# EAGLE design TA_1 (EAGLE 9.6.2)
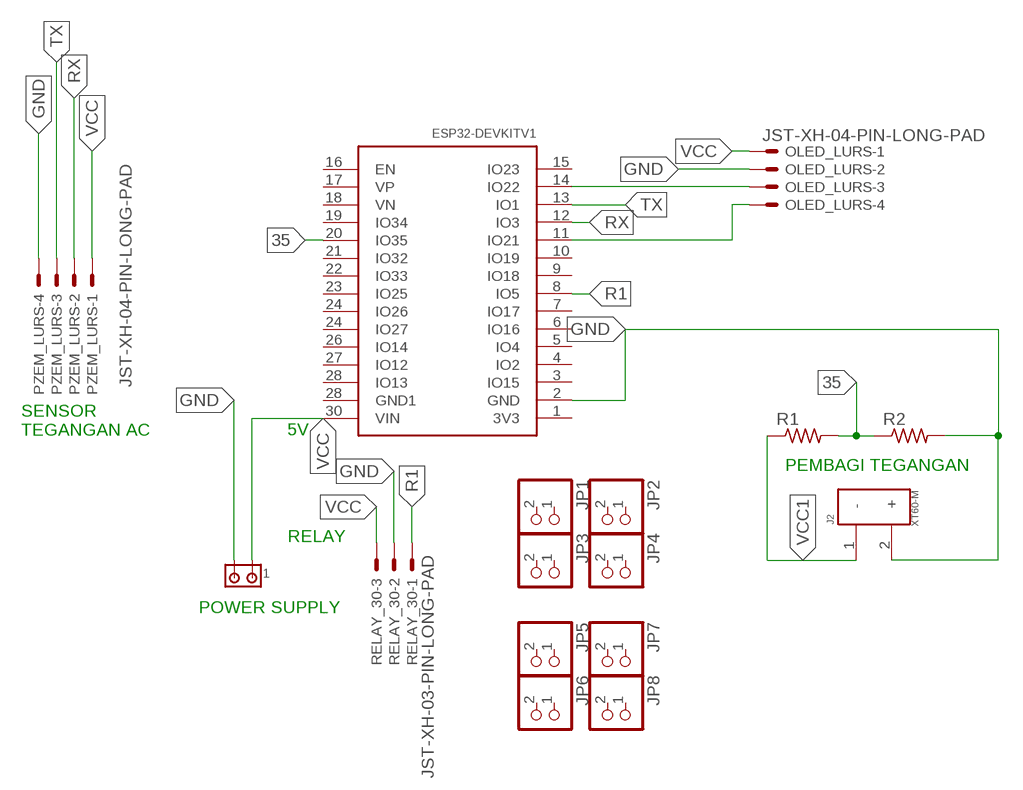
[diagram p0: schematic, sheet 1]

## Parts
J1  350428-1  [350428-1]
J2  XT60-M  [AMASS_XT60-M]
JP1  PINHD-1X2  [1X02]
JP2  PINHD-1X2  [1X02]
JP3  PINHD-1X2  [1X02]
JP4  PINHD-1X2  [1X02]
JP5  PINHD-1X2  [1X02]
JP6  PINHD-1X2  [1X02]
JP7  PINHD-1X2  [1X02]
JP8  PINHD-1X2  [1X02]
OLED_LURS  JST-XH-04-PIN-LONG-PAD  [JST-XH-04-PACKAGE-LONG-PAD]
PZEM_LURS  JST-XH-04-PIN-LONG-PAD  [JST-XH-04-PACKAGE-LONG-PAD]
R1  R-US_0207/10  [0207/10]
R2  R-US_0207/10  [0207/10]
RELAY_30  JST-XH-03-PIN-LONG-PAD  [JST-XH-03-PACKAGE-LONG-PAD]
U$1  ESP32DEVKITV1  [ESP32-DEVKITV1]

## Nets
35: R1.2 R2.1 U$1.20(IO35)
GND: J1.2 J2.2(+) OLED_LURS.2 PZEM_LURS.4 R2.2 RELAY_30.2 U$1.2(GND)
N$7: OLED_LURS.4 U$1.11(IO21)
N$8: OLED_LURS.3 U$1.14(IO22)
R1: RELAY_30.1 U$1.8(IO5)
RX: PZEM_LURS.2 U$1.12(IO3)
TX: PZEM_LURS.3 U$1.13(IO1)
VCC: J1.1 OLED_LURS.1 PZEM_LURS.1 RELAY_30.3 U$1.30(VIN)
VCC1: J2.1(-) R1.1
Unconnected: JP1.1 JP1.2 JP2.1 JP2.2 JP3.1 JP3.2 JP4.1 JP4.2 JP5.1 JP5.2 JP6.1 JP6.2 JP7.1 JP7.2 JP8.1 JP8.2 U$1.1(3V3) U$1.3(IO15) U$1.4(IO2) U$1.5(IO4) U$1.6(IO16) U$1.7(IO17) U$1.9(IO18) U$1.10(IO19) U$1.15(IO23) U$1.16(EN) U$1.17(VP) U$1.18(VN) U$1.19(IO34) U$1.21(IO32) U$1.22(IO33) U$1.23(IO25) U$1.24(IO26) U$1.24(IO27) U$1.26(IO14) U$1.27(IO12) U$1.28(GND1) U$1.28(IO13)

## Notes on the sheet
- SENSOR 
  TEGANGAN AC
- 5V
- PEMBAGI TEGANGAN
- RELAY
- POWER SUPPLY

## Library data of the parts
J1 = con-amp:350428-1: Universal MATE-N-LOK .250" Centerline, 600 V, 19 - 36 A max Source: http://catalog.tycoelectronics.com/ .. ENG_CD_350428_Y.pdf
J2 = XT60-M:XT60-M: DC supply; XT60; male; PIN:2; for cable; soldered; 60A; 500V Check availability <https://pricing.snapeda.com/parts/XT60-M/AMASS/view-part?ref=eda>; AVAILABILITY: Not in stock; DESCRIPTION: Plug; DC supply; XT60; male; PIN: 2; for cable; soldered; 30A; 500V; MF: AMASS; MP: XT60-M; PACKAGE: Package; PRICE: None
JP1-JP8 = pinhead:PINHD-1X2: PIN HEADER
OLED_LURS PZEM_LURS = Rembrandt Electronics - JST XH Connectors v1-0:JST-XH-04-PIN: JST XH Connector 2 Pin Wire to board connector. Pitch: 2,54 mm, (0.100") Number of pins: 4 Created by Rembrandt Electronics www.rembrandtelectronics.com
R1 R2 = rcl:R-US_: RESISTOR, American symbol; SPICEPREFIX: R
RELAY_30 = Rembrandt Electronics - JST XH Connectors v1-0:JST-XH-03-PIN: JST XH Connector 2 Pin Wire to board connector. Pitch: 2,54 mm, (0.100") Number of pins: 3 Created by Rembrandt Electronics www.rembrandtelectronics.com
U$1 = ESP32-DEVKITV1:ESP32DEVKITV1

## Module OLED
Ports: 

### Library data of the parts

## Board
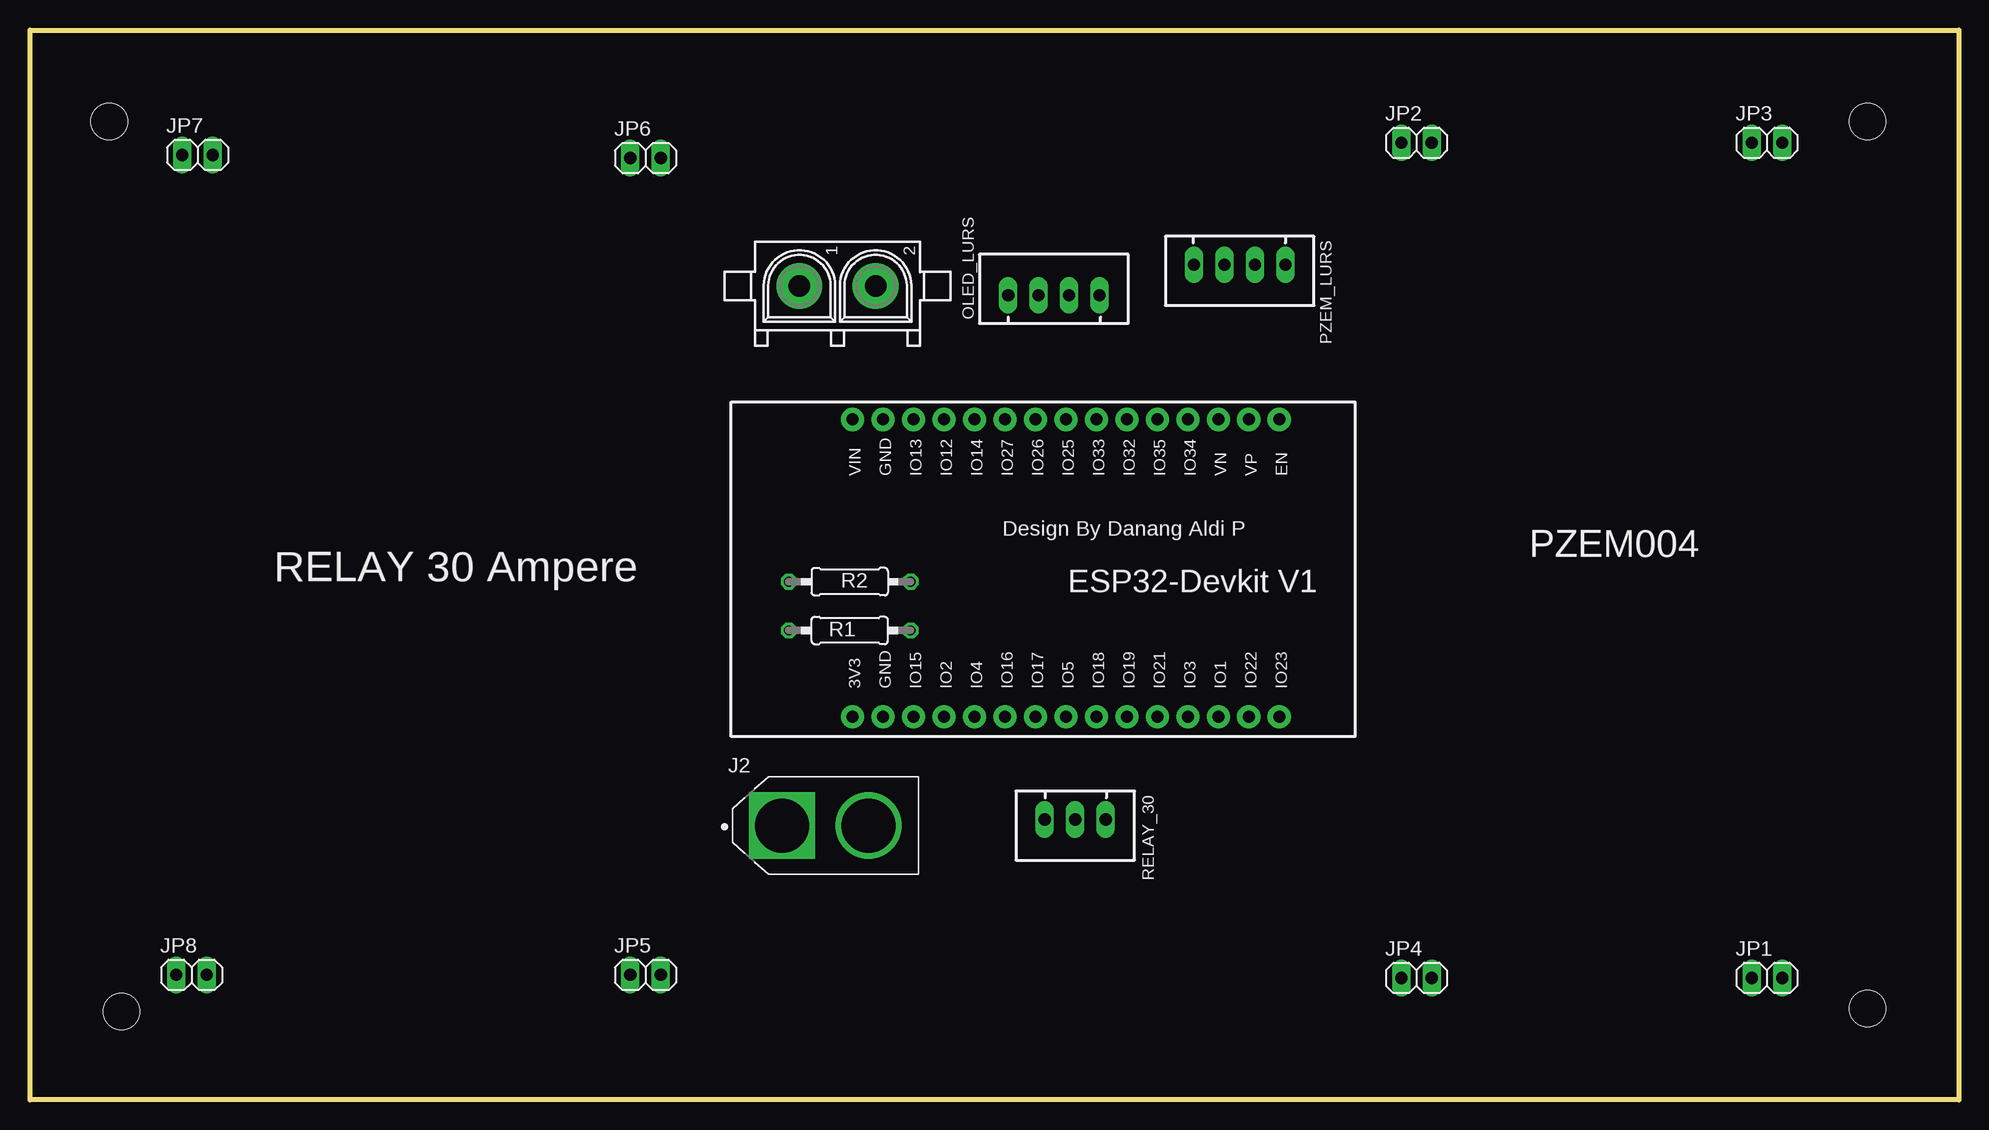
[diagram p1: board, top side]
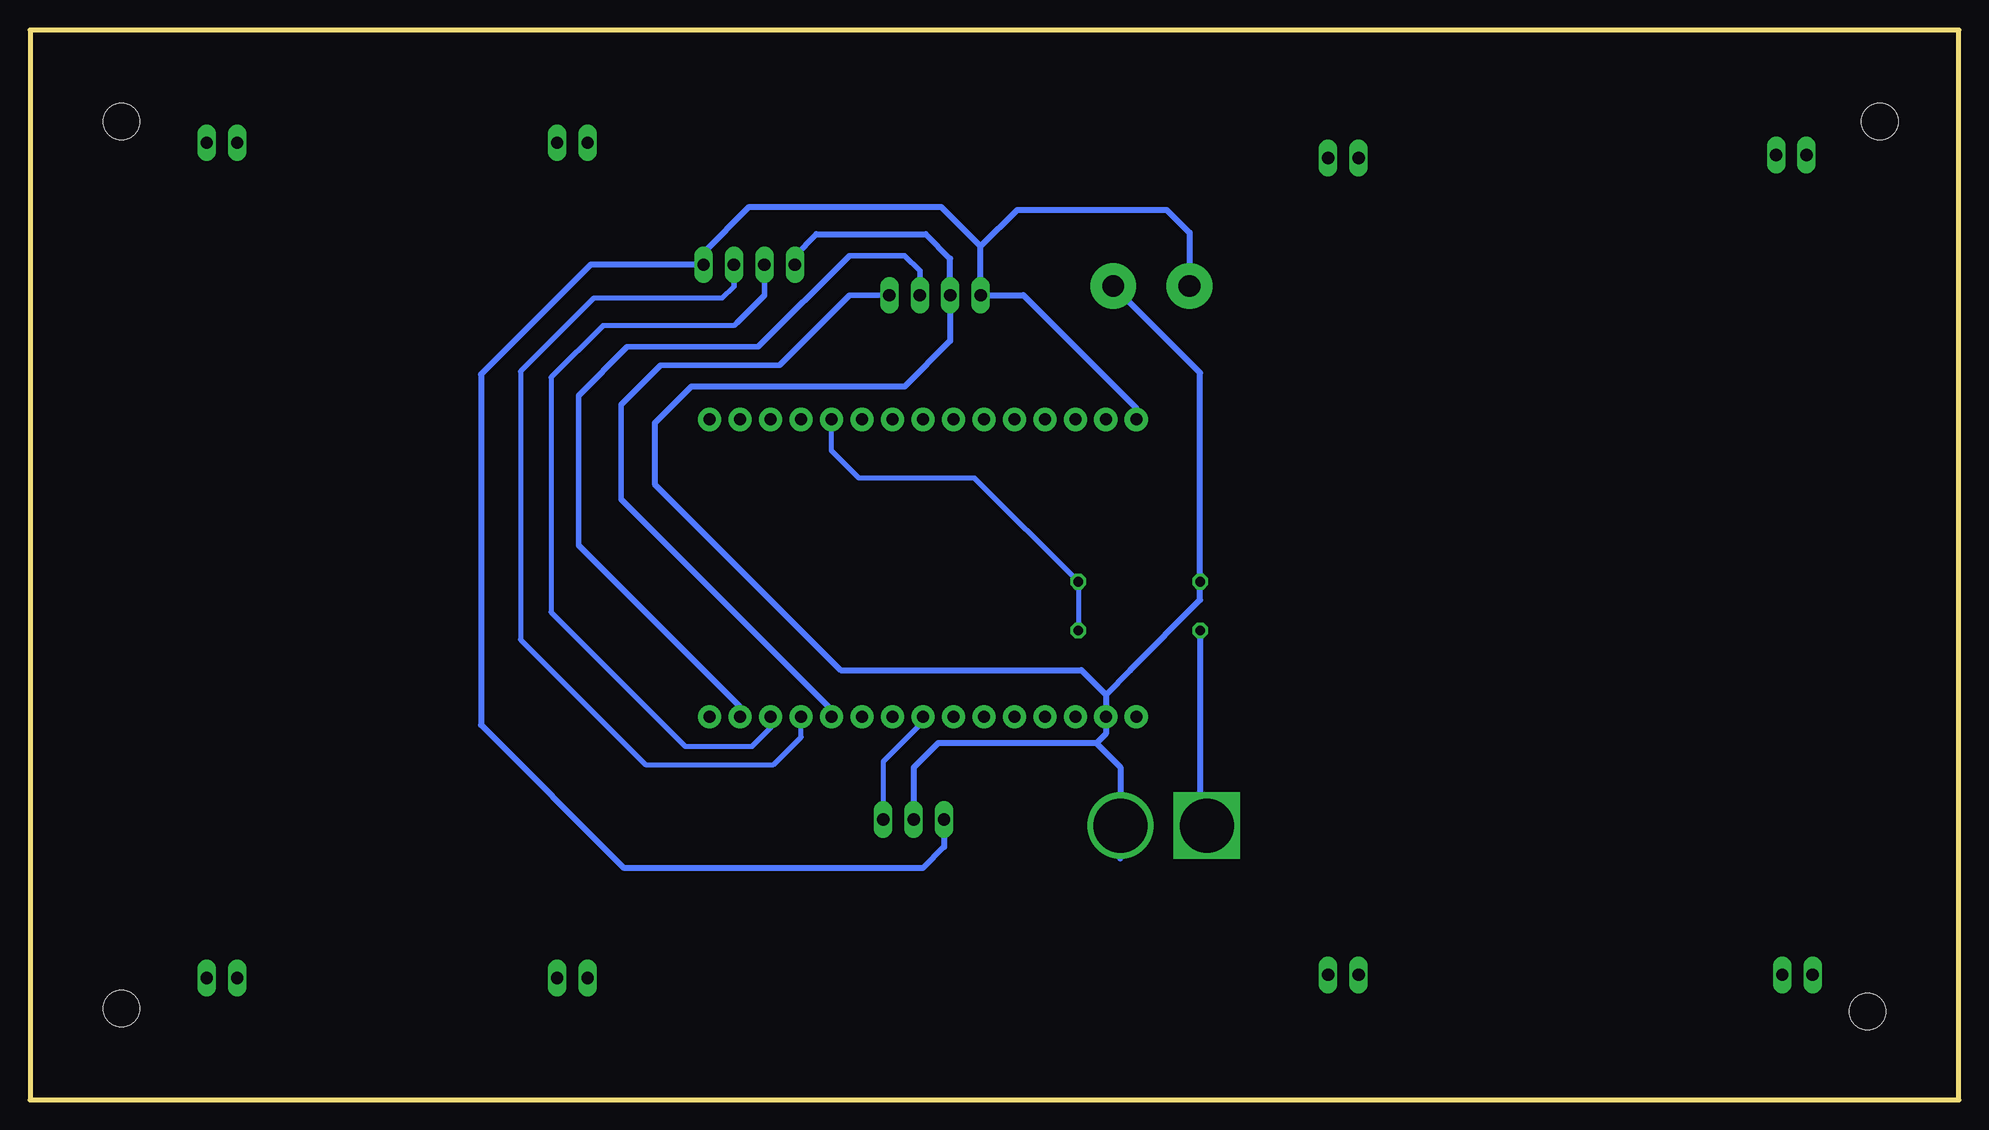
[diagram p2: board, bottom side, seen from below]

Size 160.78 x 89.15 mm. Coordinates in mm from the lower left corner, seen from the top.
Outline: 0,0 0,89.15 160.78,89.15 160.78,0 0,0
Copper layers (1*16): Top 0.035mm / dielectric 1.5mm / Bottom 0.035mm
Design rules "default": minimum track width 6mil, minimum drill 0.35mm, track to track 6mil, track to pad 6mil, pad to pad 6mil, via to via 6mil, smd to smd 6mil, copper to edge 40mil, drill to drill 6mil, minimum pad ring 10mil, minimum via ring 8mil, stop-mask expansion 4mil, vias tented up to drill 0mil, thermal gap 10mil
Holes 3.05 mm at 6.6,81.53 153.16,81.53 153.16,7.62 7.62,7.37

### Footprints (pad centres in the part's own frame; a part is rotated, then mirrored left to right if it is on the bottom)
350428-1 = drill 1.8 pad 3.81: 1 -3.175,0; 2 3.175,0
AMASS_XT60-M = drill 4.5 square: 1 -3.6,0 | drill 4.5: 2 3.6,0
1X02 = drill 1.016 long: 1 -1.27,0; 2 1.27,0
JST-XH-04-PACKAGE-LONG-PAD = drill 1.016 long: 1 -3.81,0; 2 -1.27,0; 3 1.27,0; 4 3.81,0
0207/10 = drill 0.813 octagon: 1 -5.08,0; 2 5.08,0
JST-XH-03-PACKAGE-LONG-PAD = drill 1.016 long: 1 -2.54,0; 2 0,0; 3 2.54,0
ESP32-DEVKITV1 = drill 1 pad 1.93: 1 -22.87,-13.54; 2 -20.33,-13.54; 3 -17.79,-13.54; 4 -15.25,-13.54; 5 -12.71,-13.54; 6 -10.17,-13.54; 7 -7.63,-13.54; 8 -5.09,-13.54; 9 -2.55,-13.54; 10 -0.01,-13.54; 11 2.53,-13.54; 12 5.07,-13.54; 13 7.61,-13.54; 14 10.15,-13.54; 15 12.69,-13.54; 16 12.69,11.23; 17 10.15,11.23; 18 7.61,11.23; 19 5.07,11.23; 20 2.53,11.23; 21 -0.01,11.23; 22 -2.55,11.23; 23 -5.09,11.23; 24 -7.63,11.23; 25 -10.17,11.23; 26 -12.71,11.23; 27 -15.25,11.23; 28 -17.79,11.23; 29 -20.33,11.23; 30 -22.87,11.23

### Placement (x,y rotation side)
J1  67.31,67.82 0 top
J2  66.29,22.86 0 top
JP1  144.78,10.16 0 top
JP2  115.57,79.76 0 top
JP3  144.78,79.76 0 top
JP4  115.57,10.16 0 top
JP5  51.31,10.41 0 top
JP6  51.31,78.49 0 top
JP7  13.97,78.74 0 top
JP8  13.46,10.41 0 top
OLED_LURS  85.34,67.06 0 top
PZEM_LURS  100.84,69.6 180 top
R1  68.33,39.12 0 top
R2  68.33,43.18 180 top
RELAY_30  87.12,23.37 180 top
U$1  91.44,45.47 0 top

### Tracks (layer width: path | path; a pad name or v marks a point on that pad's centre or on a via)
35
  Bottom 0.406: R1.2 R2.1 82.04,51.82 91.69,51.82 93.97,54.09 U$1.20
GND
  Bottom 0.508: 71.88,29.72 85.09,29.72 87.12,27.69 RELAY_30.2 | 71.88,29.72 71.11,30.49 U$1.2 71.11,33.77 | PZEM_LURS.4 97.03,70.36 95.25,72.14 86.11,72.14 84.07,70.1 OLED_LURS.2 84.07,63.25 87.88,59.44 105.66,59.44 108.71,56.39 108.71,51.31 93.22,35.81 73.15,35.81 71.11,33.77 | 71.88,29.72 69.89,27.73 J2.2 69.89,20.11 | J1.2 63.25,60.58 R2.2 63.25,41.66 69.09,35.81 69.09,35.79 71.11,33.77
N$7
  Bottom 0.457: U$1.11 93.98,32.51 111.51,50.04 111.51,57.91 108.2,61.21 98.3,61.21 92.46,67.06 OLED_LURS.4
N$8
  Bottom 0.457: OLED_LURS.3 86.61,69.09 87.88,70.36 92.46,70.36 100.08,62.74 111,62.74 115.06,58.67 115.06,46.23 101.59,32.76 U$1.14
R1
  Bottom 0.406: U$1.8 86.35,31.51 89.66,28.19 RELAY_30.1
RX
  Bottom 0.406: U$1.12 96.51,30.24 98.81,27.94 109.47,27.94 119.89,38.35 119.89,60.71 113.79,66.8 103.12,66.8 102.11,67.82
  Bottom 0.457: 102.11,67.82 PZEM_LURS.2
TX
  Bottom 0.406: U$1.13 99.05,31 100.58,29.46 106.17,29.46 117.35,40.64 117.35,60.2 113.03,64.52 102.11,64.52 101.85,64.77
  Bottom 0.457: 101.85,64.77 99.57,67.06 PZEM_LURS.3
VCC
  Bottom 0.508: J1.1 64.14,72.26 66.04,74.17 78.49,74.17 81.53,71.12 | RELAY_30.3 84.58,21.08 86.36,19.3 111.25,19.3 123.19,31.24 123.19,60.45 114.05,69.6 PZEM_LURS.1 104.65,70.61 100.84,74.42 84.84,74.42 81.53,71.12 | U$1.30 68.57,57.65 77.98,67.06 OLED_LURS.1 81.53,71.12
VCC1
  Bottom 0.508: R1.1 63.25,23.41 J2.1

### Text on the board
tPlace: Design By Danang Aldi P | RELAY 30 Ampere
tNames: PZEM004